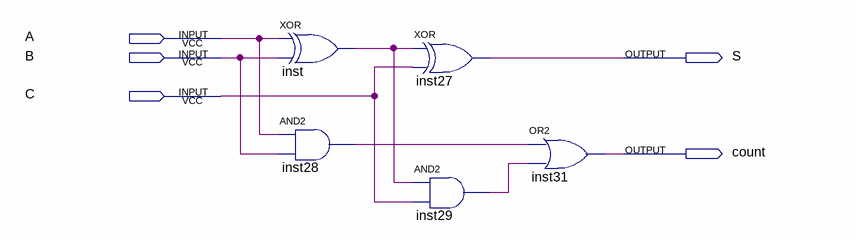
[diagram p0: schematic sheet]
// Quartus schematic fulladd.bdf as structural Verilog: 5 symbols, 5 pins
module fulladd (
  input  A,
  input  B,
  input  C,
  output S,
  output count
);

  wire inst28_out, inst29_out, inst_out;

  xor inst (inst_out, A, B);
  and inst28 (inst28_out, A, B);
  xor inst27 (S, inst_out, C);
  and inst29 (inst29_out, inst_out, C);
  or inst31 (count, inst28_out, inst29_out);
endmodule
